# Altium schematic sheet 3_PWM Generator.SchDoc
size A4; SheetNumber: 4; SheetTotal: 6
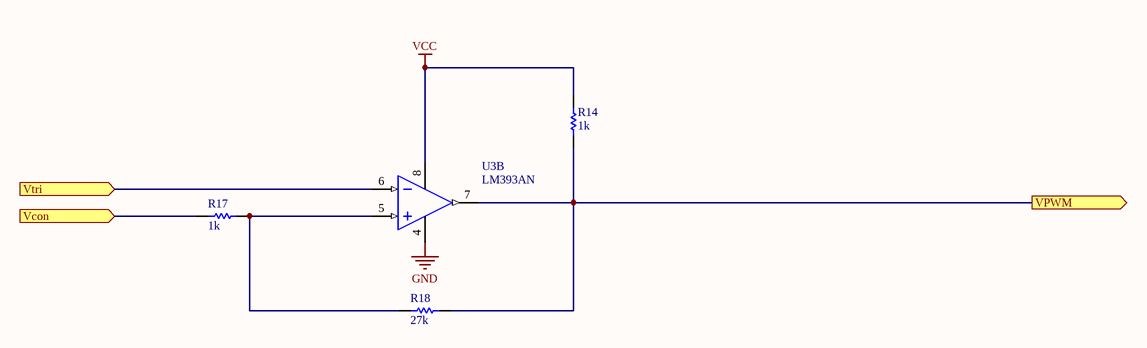
[diagram p0: 3_PWM Generator.SchDoc]

## Parts
R14  1k  [ece-AXIAL0.4]
R17  1k  [ece-AXIAL0.4]
R18  27k  [ece-AXIAL0.4]
U3  LM393AN  [ECE-DIP8]  (part B of 2)

## Ports
Vcon (in), VPWM (out), Vtri (in)

## Nets
GND: U3.4(GND)
VCC: R14.1 U3.8(V+)
Vcon: R17.2 ; port Vcon
VPWM: R14.2 R18.1 U3.7(OUT) ; port VPWM
Vtri: U3.6(IN-) ; port Vtri
NetR17_1: R17.1 R18.2 U3.5(IN+)

## Library data of the parts
R14 R17 R18 = Res1: Resistor; Published: 8-Jun-2000; LatestRevisionDate: 17-Jul-2002; LatestRevisionNote: Re-released for DXP Platform.; PackageReference: AXIAL-0.3; Publisher: Altium Limited
  R14 R17: Value: 1k
  R18: Value: 27k
U3 = LM393AN: Dual Comparator; Published: 17-Jul-2002; LatestRevisionDate: 06-Jun-2005; LatestRevisionNote: Stylized 3D Model Added.; DatasheetVersion: 1988; PackageReference: 626-05; Publisher: Altium Limited; PackageDescription: DIP; 8 Leads; Row Spacing 7.62 mm; Pitch 2.54 mm; ComponentLink1Description: Manufacturer Link; ComponentLink1URL: http://www.onsemi.com/site/products/taxonomy/0,4438,133,00.html